# Altium schematic sheet kd_inz_mems.SchDoc
size A3; SheetNumber: 2; SheetTotal: 3
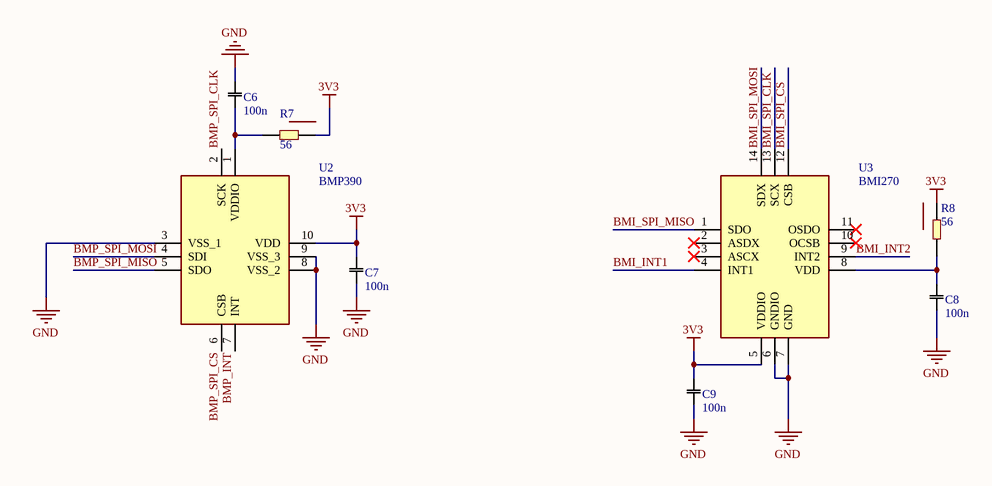
[diagram p0: kd_inz_mems.SchDoc]

## Parts
C6  100n  [0402]
C7  100n  [0402]
C8  100n  [0402]
C9  100n  [0402]
R7  56  [0402]
R8  56  [0402]
U2  BMP390  [BMP390]
U3  BMI270  [QFN50P300X250X87-14N]

## Nets
3V3: C7.2 C9.2 R7.2 R8.2 U2.10(VDD) U3.5(VDDIO)
GND: C6.2 C7.1 C8.1 C9.1 U2.3(VSS_1) U2.8(VSS_2) U2.9(VSS_3) U3.6(GNDIO) U3.7(GND)
BMI_INT1: U3.4(INT1)
BMI_INT2: U3.9(INT2)
BMI_SPI_CLK: U3.13(SCX)
BMI_SPI_CS: U3.12(CSB)
BMI_SPI_MISO: U3.1(SDO)
BMI_SPI_MOSI: U3.14(SDX)
BMP_INT: U2.7(INT)
BMP_SPI_CLK: U2.2(SCK)
BMP_SPI_CS: U2.6(CSB)
BMP_SPI_MISO: U2.5(SDO)
BMP_SPI_MOSI: U2.4(SDI)
NetC6_1: C6.1 R7.1 U2.1(VDDIO)
NetC8_2: C8.2 R8.1 U3.8(VDD)

Not connected (* = marked no-connect by the designer): U3 2(ASDX)* 3(ASCX)* 10(OCSB)* 11(OSDO)*

## Library data of the parts
C6-C9 = C: Capacitor
R7 R8 = R: Resistor
U2 = BMP390: Integrated Circuit; Manufacturer_Name: BOSCH; Datasheet Link: https://www.bosch-sensortec.com/media/boschsensortec/downloads/datasheets/bst-bmp390-ds002.pdf; Height: 0.8mm; Manufacturer_Part_Number: BMP390; Mouser Part Number: 262-BMP390; Mouser Price/Stock: https://www.mouser.co.uk/ProductDetail/Bosch-Sensortec/BMP390?qs=QNEnbhJQKvYQVfvRMgo2YA%3D%3D; Arrow Part Number: BMP390; Arrow Price/Stock: https://www.arrow.com/en/products/bmp390/bosch?region=nac
U3 = BMI270: Integrated Circuit; Manufacturer_Name: BOSCH; Datasheet Link: https://www.mouser.de/datasheet/2/783/BST-BMI270-FL000-1530947.pdf; Height: 0.87mm; Manufacturer_Part_Number: BMI270; Mouser Part Number: 262-BMI270; Mouser Price/Stock: https://www.mouser.co.uk/ProductDetail/Bosch-Sensortec/BMI270?qs=u16ybLDytRYIj%252BjQEee88A%3D%3D; Arrow Part Number: BMI270; Arrow Price/Stock: https://www.arrow.com/en/products/bmi270/bosch?region=nac